# Altium project mic_preamp_psu.PrjPcb
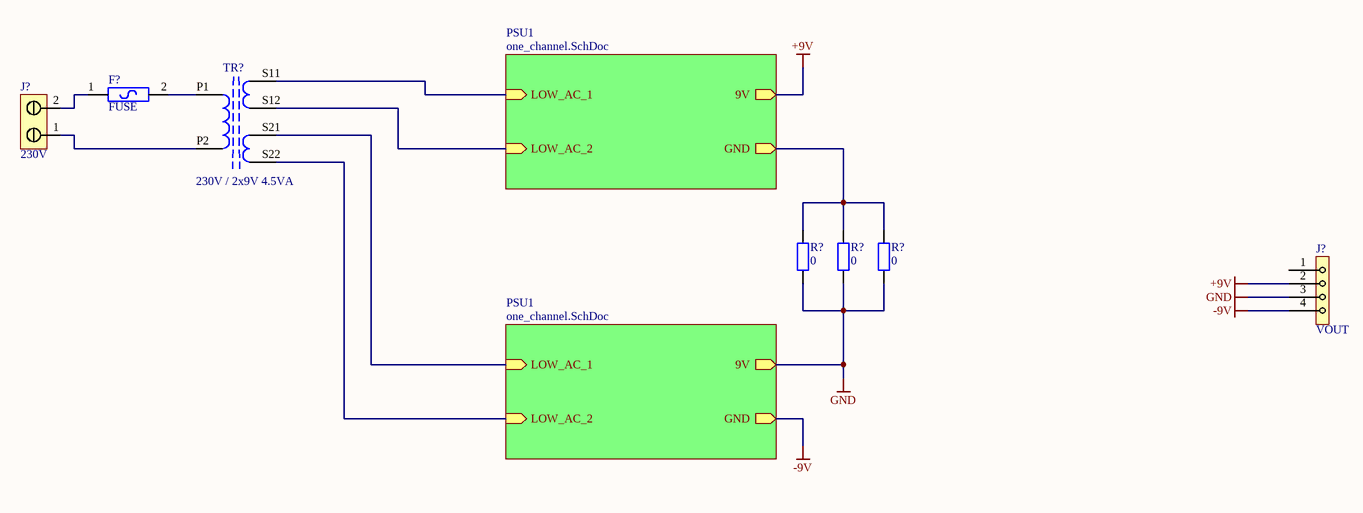
[diagram p0: psu.SchDoc]
2 sheets, 31 parts. Net scope: hierarchical (ports join the sheet entries above them; power ports are global).
Sheets:
  psu.SchDoc
    PSU1 = one_channel.SchDoc
    PSU1 = one_channel.SchDoc

## Sheet psu.SchDoc
size A4; SheetNumber: 1; SheetTotal: 2

### Parts
(Parts that share a designator on the sheet are numbered #1, #2 ... from top to bottom, then left to right.)
F?  FUSE
J?#1  230V  [KFS-5.0-2P-I]
J?#2  VOUT  [PIN_HEADER_1L_4P]
R?#1  Resistance: 0  (hidden comment: Resistor)
R?#2  Resistance: 0  (hidden comment: Resistor)
R?#3  Resistance: 0  (hidden comment: Resistor)
TR?  230V / 2x9V 4.5VA  [TRANSFORMER_1P_2S_MAKRAI]

### Sub-sheets
PSU1 = one_channel.SchDoc: LOW_AC_2 (in), LOW_AC_1 (in), 9V (out), GND (out)
PSU1 = one_channel.SchDoc: LOW_AC_2 (in), LOW_AC_1 (in), 9V (out), GND (out)

### Nets
+9V: J?#2.2 ; sheet PSU1/9V
-9V: J?#2.4 ; sheet PSU1/GND
GND: J?#2.3 R?#1.2 R?#2.2 R?#3.2 ; sheet PSU1/9V
NetC?_PSU1#1_1: R?#1.1 R?#2.1 R?#3.1 ; sheet PSU1/GND
NetD?_PSU1#1_1: TR?.S12 ; sheet PSU1/LOW_AC_2
NetD?_PSU1#2_1: TR?.S11 ; sheet PSU1/LOW_AC_1
NetD?_PSU1#5_1: TR?.S22 ; sheet PSU1/LOW_AC_2
NetD?_PSU1#6_1: TR?.S21(S3) ; sheet PSU1/LOW_AC_1
NetF?_1: F?.1 J?#1.2
NetF?_2: F?.2 TR?.P1
NetJ?#1_1: J?#1.1 TR?.P2

Not connected (* = marked no-connect by the designer): J?#2 1

### Library data of the parts
J?#1 = KFS-5.0-2P-I: Sorkapocs, 90 fokos, 5mm, Pólusok száma: 2, 0.5...2.5mm2
J?#2 = PIN_HEADER_1L_4P
R?#1-R?#3 = Resistor: EU symbol
TR? = Transformer_2

## Sheet one_channel.SchDoc
size A3; SheetNumber: 2; SheetTotal: 2
Used 2 times, as channels PSU1, PSU1. Parts and nets are listed once, with the designators drawn on the sheet.
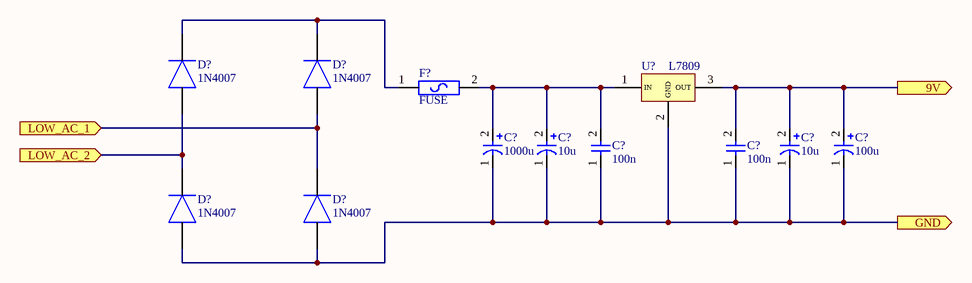
[diagram p1: one_channel.SchDoc]

### Parts
(Parts that share a designator on the sheet are numbered #1, #2 ... from top to bottom, then left to right.)
C?#1  1000u
C?#2  10u
C?#3  100n  [FP-1206-L_3_2_0_2-W_1_6_0-IPC_B]
C?#4  100n  [FP-1206-L_3_2_0_2-W_1_6_0-IPC_B]
C?#5  10u
C?#6  100u
D?#1  1N4007  [DIODE_THT]
D?#2  1N4007  [DIODE_THT]
D?#3  1N4007  [DIODE_THT]
D?#4  1N4007  [DIODE_THT]
F?  FUSE  [FUSE_SOCKET_5x20mm]
U?  L7809  [TO-220]

### Ports
9V (out, see psu[3B]), GND (out, see psu[3B]), LOW_AC_1 (in, see psu[2B]), LOW_AC_2 (in, see psu[2B])

### Nets
9V: C?#4.2 C?#5.2 C?#6.2 U?.3(OUT) ; port 9V
GND: C?#1.1 C?#2.1 C?#3.1 C?#4.1 C?#5.1 C?#6.1 D?#3.1(A) D?#4.1(A) U?.2(GND) ; port GND
LOW_AC_1: D?#2.1(A) D?#4.2(K) ; port LOW_AC_1
LOW_AC_2: D?#1.1(A) D?#3.2(K) ; port LOW_AC_2
NetC?#1_2: C?#1.2 C?#2.2 C?#3.2 F?.2 U?.1(IN)
NetD?#1_2: D?#1.2(K) D?#2.2(K) F?.1

### Channels
PSU1: designators C?=C?_PSU1#4 C?=C?_PSU1#3 C?=C?_PSU1#5 C?=C?_PSU1#6 C?=C?_PSU1#2 C?=C?_PSU1#1 D?=D?_PSU1#1 D?=D?_PSU1#2 D?=D?_PSU1#3 D?=D?_PSU1#4 F?=F?_PSU1#1 U?=U?_PSU1#1; ports 9V=+9V GND=NetC?_PSU1#1_1 LOW_AC_1=NetD?_PSU1#2_1 LOW_AC_2=NetD?_PSU1#1_1
PSU1: designators C?=C?_PSU1#10 C?=C?_PSU1#9 C?=C?_PSU1#11 C?=C?_PSU1#12 C?=C?_PSU1#8 C?=C?_PSU1#7 D?=D?_PSU1#5 D?=D?_PSU1#6 D?=D?_PSU1#7 D?=D?_PSU1#8 F?=F?_PSU1#2 U?=U?_PSU1#2; ports 9V=GND GND=-9V LOW_AC_1=NetD?_PSU1#6_1 LOW_AC_2=NetD?_PSU1#5_1

### Library data of the parts
C?#1 C?#2 C?#5 C?#6 = cap_pol
C?#3 C?#4 = cap_unpol
D?#1-D?#4 = 1N4148

## Nets that join several sheets
+9V: psu (J?#2.2), PSU1 (C?_PSU1#4.2 C?_PSU1#5.2 C?_PSU1#6.2 U?_PSU1#1.3)
-9V: psu (J?#2.4), PSU1 (9 pins)
GND: psu (J?#2.3 R?#1.2 R?#2.2 R?#3.2), PSU1 (C?_PSU1#10.2 C?_PSU1#11.2 C?_PSU1#12.2 U?_PSU1#2.3)
NetC?_PSU1#1_1: psu (R?#1.1 R?#2.1 R?#3.1), PSU1 (9 pins)
NetD?_PSU1#1_1: psu (TR?.S12), PSU1 (D?_PSU1#1.1 D?_PSU1#3.2)
NetD?_PSU1#2_1: psu (TR?.S11), PSU1 (D?_PSU1#2.1 D?_PSU1#4.2)
NetD?_PSU1#5_1: psu (TR?.S22), PSU1 (D?_PSU1#5.1 D?_PSU1#7.2)
NetD?_PSU1#6_1: psu (TR?.S21), PSU1 (D?_PSU1#6.1 D?_PSU1#8.2)